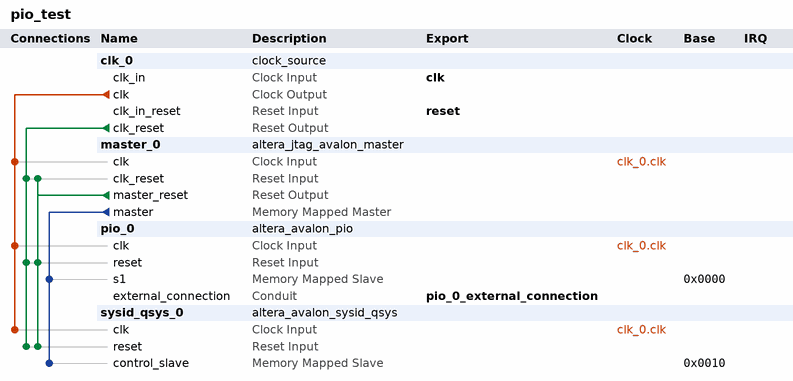
[diagram p0: system contents]
# Platform Designer (Qsys) system pio_test, MAX 10 10M50DAF484C6GES
# Parameters at their usual value, and those the tool derives, are not listed.
package require -exact qsys 16.1
create_system pio_test
set_project_property DEVICE_FAMILY {MAX 10}
set_project_property DEVICE 10M50DAF484C6GES

add_instance clk_0 clock_source 16.1
set_instance_parameter_value clk_0 clockFrequency 50000000

add_instance master_0 altera_jtag_avalon_master 16.1

add_instance pio_0 altera_avalon_pio 16.1
set_instance_parameter_value pio_0 direction Output
set_instance_parameter_value pio_0 width 8

add_instance sysid_qsys_0 altera_avalon_sysid_qsys 16.1
set_instance_parameter_value sysid_qsys_0 id 305419896

# connections
add_connection clk_0.clk master_0.clk clock
add_connection clk_0.clk pio_0.clk clock
add_connection clk_0.clk sysid_qsys_0.clk clock
add_connection clk_0.clk_reset master_0.clk_reset reset
add_connection clk_0.clk_reset pio_0.reset reset
add_connection clk_0.clk_reset sysid_qsys_0.reset reset
add_connection master_0.master_reset master_0.clk_reset reset
add_connection master_0.master_reset pio_0.reset reset
add_connection master_0.master_reset sysid_qsys_0.reset reset
add_connection master_0.master pio_0.s1 avalon
set_connection_parameter_value master_0.master/pio_0.s1 baseAddress 0x0000
add_connection master_0.master sysid_qsys_0.control_slave avalon
set_connection_parameter_value master_0.master/sysid_qsys_0.control_slave baseAddress 0x0010

# exported interfaces
add_interface clk clock sink
set_interface_property clk EXPORT_OF clk_0.clk_in
add_interface pio_0_external_connection conduit end
set_interface_property pio_0_external_connection EXPORT_OF pio_0.external_connection
add_interface reset reset sink
set_interface_property reset EXPORT_OF clk_0.clk_in_reset

set_interconnect_requirement {$system} qsys_mm.clockCrossingAdapter HANDSHAKE
set_interconnect_requirement {$system} qsys_mm.enableEccProtection FALSE
set_interconnect_requirement {$system} qsys_mm.insertDefaultSlave FALSE
set_interconnect_requirement {$system} qsys_mm.maxAdditionalLatency 1

save_system pio_test.qsys
